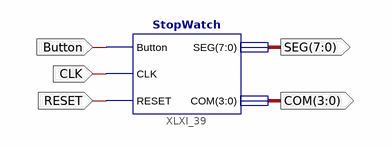
[diagram p0: schematic sheet 1]
// Xilinx ISE schematic main.sch (spartan6) as structural Verilog: 1 symbols, 5 ports
module main (
  input  Button,
  input  RESET,
  input  CLK,
  output [3:0] COM,
  output [7:0] SEG
);

  StopWatch XLXI_39 (.CLK(CLK), .RESET(RESET), .SEG(SEG), .COM(COM), .Button(Button));

  // Notes on the sheet:
  //   LOC on signal Button = P45
  //   CLOCK_DEDICATED_ROUTE on signal Button = TRUE
  //   LOC on signal RESET = P46
  //   LOC on signal CLK = P123
  //   LOC on signal COM(3:0) = P30,P33,P43,P44
  //   LOC on signal SEG(7:0) = P26,P27,P29,P32,P34,P35,P40,P41
endmodule
